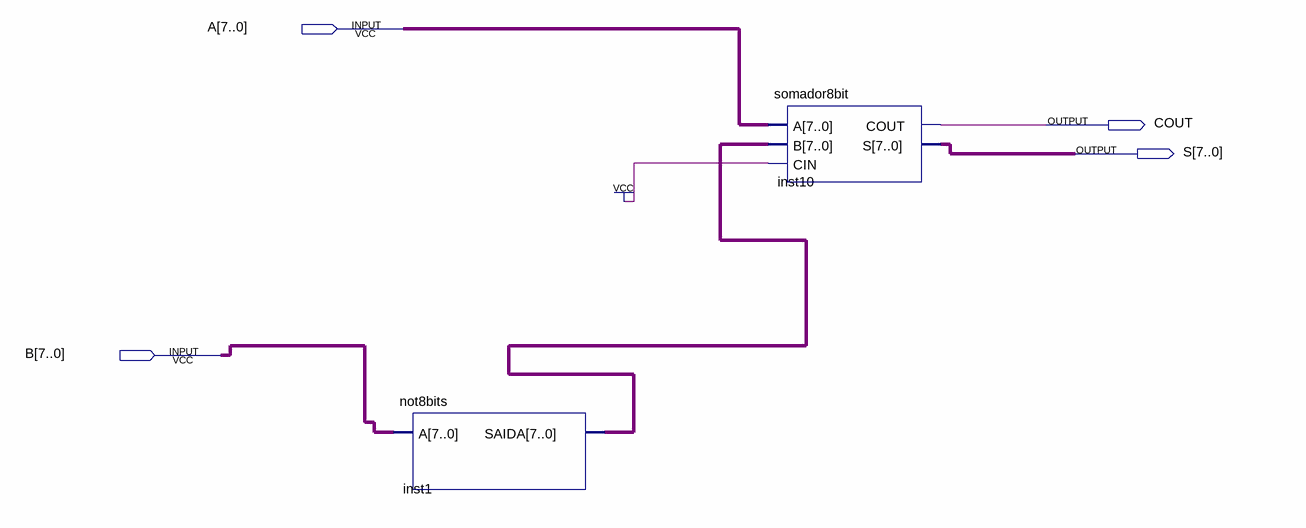
[diagram p0: schematic sheet]
// Quartus schematic subtrator8bit.bdf as structural Verilog: 2 symbols, 4 pins
module subtrator8bit (
  input  [7:0] A,
  input  [7:0] B,
  output COUT,
  output [7:0] S
);

  wire [7:0] inst1_saida;

  not8bits inst1 (.A(B), .SAIDA(inst1_saida));
  somador8bit inst10 (.A(A), .B(inst1_saida), .CIN(1'b1), .COUT(COUT), .S(S));
endmodule
